# Altium schematic sheet MainBoard.SchDoc
size A4; SheetNumber: 1; SheetTotal: 1
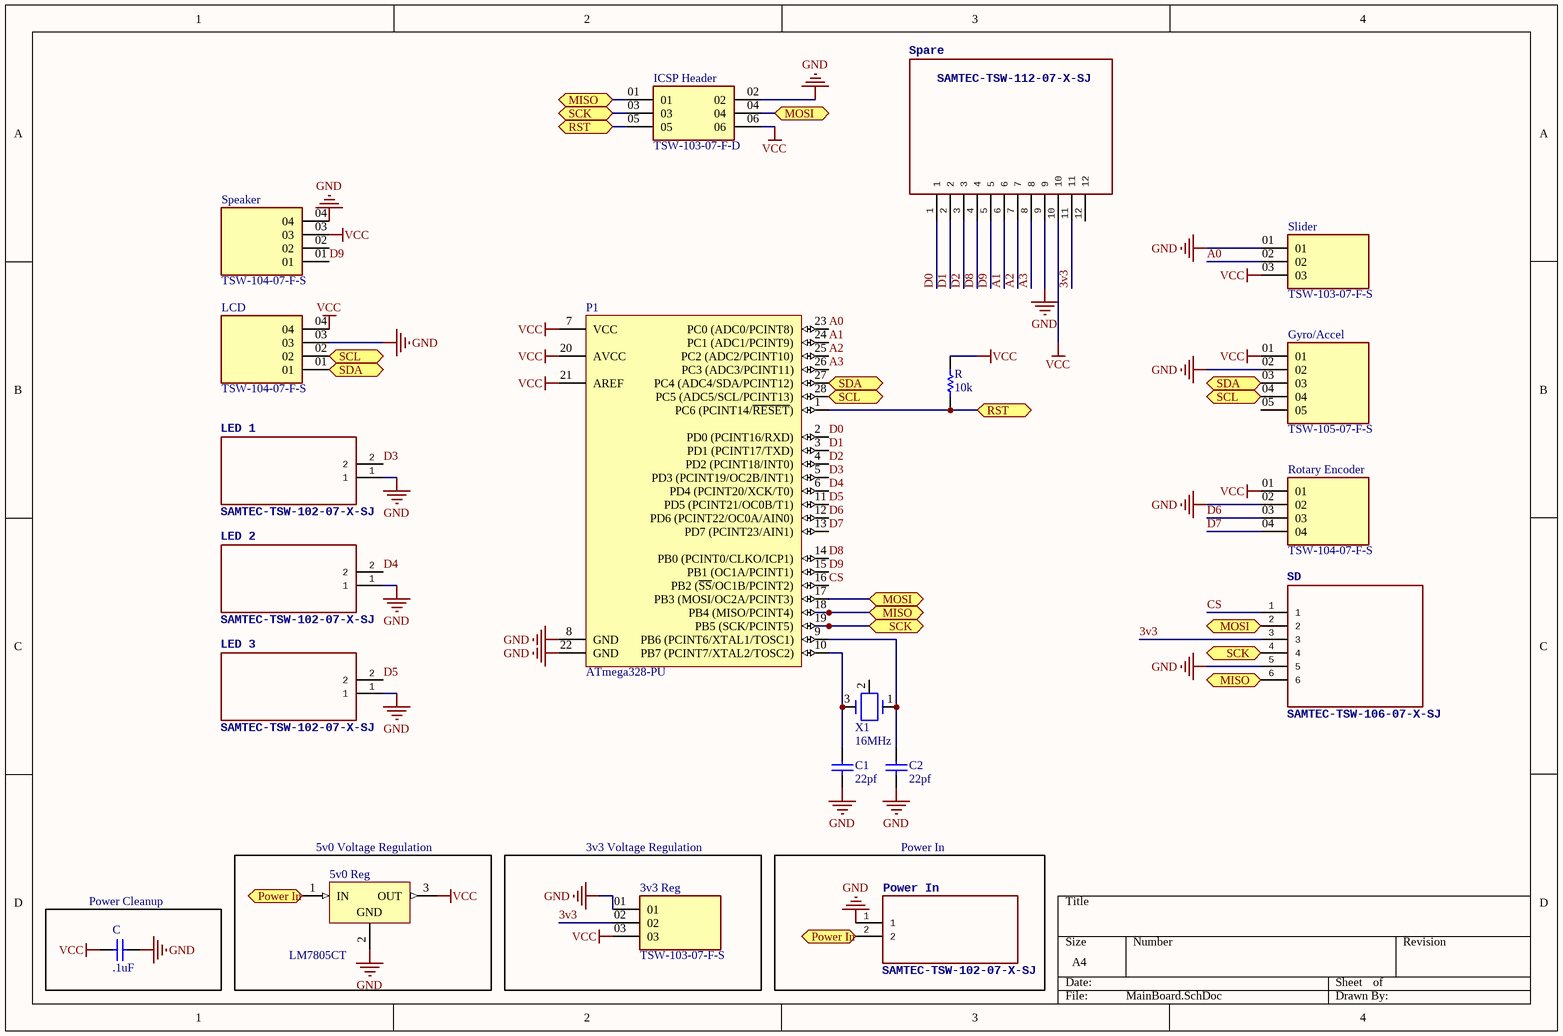
[diagram p0: MainBoard.SchDoc]

## Parts
3v3_Reg  TSW-103-07-F-S  [SAMTEC_TSW-103-07-F-S]
5v0_Reg  LM7805CT  [FAIR-TO-220-3]
C  .1uF  [KEMT-C330C105M5U5TA]
C1  22pf  [KEMT-C330C105M5U5TA]
C2  22pf  [KEMT-C330C105M5U5TA]
Gyro/Accel  TSW-105-07-F-S  [SAMTEC_TSW-105-07-F-S]
ICSP_Header  TSW-103-07-F-D  [SAMTEC_TSW-103-07-F-D]
LCD  TSW-104-07-F-S  [SAMTEC_TSW-104-07-F-S]
LED_1  SAMTEC-TSW-102-07-X-SJ  [SAMTEC-TSW-102-07-X-S]
LED_2  SAMTEC-TSW-102-07-X-SJ  [SAMTEC-TSW-102-07-X-S]
LED_3  SAMTEC-TSW-102-07-X-SJ  [SAMTEC-TSW-102-07-X-S]
P1  ATmega328-PU  [28P3]
Power_In  SAMTEC-TSW-102-07-X-SJ  [SAMTEC-TSW-102-07-X-S]
R  10k  [VISH-A1-2_V2]
Rotary_Encoder  TSW-104-07-F-S  [SAMTEC_TSW-104-07-F-S]
SD  SAMTEC-TSW-106-07-X-SJ  [SAMTEC-TSW-106-07-X-S]
Slider  TSW-103-07-F-S  [SAMTEC_TSW-103-07-F-S]
Spare  SAMTEC-TSW-112-07-X-SJ  [SAMTEC-TSW-112-07-X-S]
Speaker  TSW-104-07-F-S  [SAMTEC_TSW-104-07-F-S]
X1  16MHz  [ECS-4X-3IL]

## Blocks framed on the sheet
5v0 Voltage Regulation: 5v0_Reg
3v3 Voltage Regulation: 3v3_Reg
Power In: Power_In
Power Cleanup: C

## Ports
MISO (bidir, see MainBoard[2A], MainBoard[3C]), MISO (bidir, see MainBoard[2A], MainBoard[4C]), MISO (bidir, see MainBoard[3C], MainBoard[4C]), MOSI (bidir, see MainBoard[2A], MainBoard[3C]), MOSI (bidir, see MainBoard[2A], MainBoard[4C]), MOSI (bidir, see MainBoard[3C], MainBoard[4C]), Power In (bidir, see MainBoard[1D]), Power In (bidir, see MainBoard[3D]), RST (bidir, see MainBoard[2A]), RST (bidir, see MainBoard[3B]), SCK (bidir, see MainBoard[2A], MainBoard[3C]), SCK (bidir, see MainBoard[2A], MainBoard[4C]), SCK (bidir, see MainBoard[3C], MainBoard[4C]), SCL (bidir, see MainBoard[1B], MainBoard[3B]), SCL (bidir, see MainBoard[1B], MainBoard[4B]), SCL (bidir, see MainBoard[3B], MainBoard[4B]), SDA (bidir, see MainBoard[1B], MainBoard[3B]), SDA (bidir, see MainBoard[1B], MainBoard[4B]), SDA (bidir, see MainBoard[3B], MainBoard[4B])

## Nets
GND: 3v3_Reg.01 5v0_Reg.2(GND) C.2 C1.1 C2.1 Gyro/Accel.02 ICSP_Header.02 LCD.03 LED_1.1 LED_2.1 LED_3.1 P1.8(GND) P1.22(GND) Power_In.1 Rotary_Encoder.02 SD.5 Slider.01 Spare.9 Speaker.04
VCC: 3v3_Reg.03 5v0_Reg.3(OUT) C.1 Gyro/Accel.01 ICSP_Header.06 LCD.04 P1.7(VCC) P1.20(AVCC) P1.21(AREF) R.2 Rotary_Encoder.01 Slider.03 Spare.10 Speaker.03
3v3: 3v3_Reg.02 SD.3 Spare.11
A0: P1.23(PC0_(ADC0/PCINT8)) Slider.02
A1: P1.24(PC1_(ADC1/PCINT9)) Spare.6
A2: P1.25(PC2_(ADC2/PCINT10)) Spare.7
A3: P1.26(PC3_(ADC3/PCINT11)) Spare.8
CS: P1.16(PB2_(~{SS}/OC1B/PCINT2)) SD.1
D0: P1.2(PD0_(PCINT16/RXD)) Spare.1
D1: P1.3(PD1_(PCINT17/TXD)) Spare.2
D2: P1.4(PD2_(PCINT18/INT0)) Spare.3
D3: LED_1.2 P1.5(PD3_(PCINT19/OC2B/INT1))
D4: LED_2.2 P1.6(PD4_(PCINT20/XCK/T0))
D5: LED_3.2 P1.11(PD5_(PCINT21/OC0B/T1))
D6: P1.12(PD6_(PCINT22/OC0A/AIN0)) Rotary_Encoder.03
D7: P1.13(PD7_(PCINT23/AIN1)) Rotary_Encoder.04
D8: P1.14(PB0_(PCINT0/CLKO/ICP1)) Spare.4
D9: P1.15(PB1_(OC1A/PCINT1)) Spare.5 Speaker.01
MISO: ICSP_Header.01 P1.18(PB4_(MISO/PCINT4)) SD.6 ; port MISO
MOSI: ICSP_Header.04 P1.17(PB3_(MOSI/OC2A/PCINT3)) SD.2 ; port MOSI
Power In: 5v0_Reg.1(IN) Power_In.2 ; port Power In
RST: ICSP_Header.05 P1.1(PC6_(PCINT14/~{RESET})) R.1 ; port RST
SCK: ICSP_Header.03 P1.19(PB5_(SCK/PCINT5)) SD.4 ; port SCK
SCL: Gyro/Accel.04 LCD.02 P1.28(PC5_(ADC5/SCL/PCINT13)) ; port SCL
SDA: Gyro/Accel.03 LCD.01 P1.27(PC4_(ADC4/SDA/PCINT12)) ; port SDA
NetC1_2: C1.2 P1.10(PB7_(PCINT7/XTAL2/TOSC2)) X1.3
NetC2_2: C2.2 P1.9(PB6_(PCINT6/XTAL1/TOSC1)) X1.1

Not connected (* = marked no-connect by the designer): Gyro/Accel 05; Spare 12; Speaker 02; X1 2

## Library data of the parts
3v3_Reg Slider = TSW-103-07-F-S: MF: Samtec; Package: None; Price: None; MP: TSW-103-07-F-S; Availability: Unavailable; Value: *
5v0_Reg = CMP-2000-04938-1: Positive Voltage Regulator, 5 V, 1 A, -40 to 125 degC, 3-Pin TO-220, RoHS, Tube; Manufacturer: FairchildSemiconductor; Maximum Input Voltage: 35V; Maximum Quiescent Current: 8mA; Load Regulation: 100mV; Maximum Output Current: 2.2(Typ)A; Output Type: Fixed; Typical Dropout Voltage @ Current: 2@1AV; Rad Hard: No; Output Voltage: 5V; Accuracy: ±4%; Number of Outputs: 1; Category: LinearRegulator; Package Description: 3-Pin Through Hole Device, Body 10 x 4.5 mm, Pitch 2.54 mm; Packaging: Rail/Tube; Mounting: ThroughHole; Polarity: Positive; Manufacturer URL: https://www.fairchildsemi.com/; Line Regulation: 100mV; Datasheet Version: Aug-12; Datasheet URL: https://datasheet.ciiva.com/26904/lm7805ct-26904988.pdf; Package Reference: TO-220; Package URL: https://www.fairchildsemi.com/package-drawings/TO/TO220B03.pdf; Package: 3TO-220AB; Operating Temperature: -40to125degC; Type: Linear
C C1 C2 = CMP-2000-06056-1: Ceramic Capacitor, 1 uF, +/- 20%, 50 V, -10 to 85 degC, 2-Pin THD, RoHS, Bulk; Manufacturer: Kemet; Voltage - Rated: 50V; Temperature Coefficient: Z5U; Catalog Drawings: C330(std); Product Training Modules: CapacitorBasics-TypicalUsesforCapacitors; Capacitance: 1µF; Online Catalog: GoldenMax™Series; Other Names: 399-4390; PCN Design/Specification: C3yySeriesGoldenMaxLeadConfiguration02/Feb/2015; Thickness (Max): -; Size / Dimension: 0.300"Lx0.150"W(7.62mmx3.81mm); Mounting Technology: ThroughHole; Tolerance: ±20%; Mounting Type: ThroughHole; Datasheet URL: http://www.kemet.com/Lists/ProductCatalog/Attachments/599/KEM_C1051_GOLDMAX_Z5U.pdf; Series: GoldenMax™; Standard Package: 250; Ratings: -; Applications: GeneralPurpose; Package Reference: C330C105M5U5TA; Packaging: Bulk; Category: Capacitors; Package Description: 2-Pin Through Hole Device, Body 7.11 x 4.07 mm; Operating Temperature: 10°C~85°C; Height - Seated (Max): 0.360"(9.14mm); Manufacturer URL: http://www.kemet.com/; Lead Spacing: 0.200"(5.08mm); Features: -; Lead Style: Straight; Package / Case: Radial; Family: CeramicCapacitors; Datasheet Version: 12/2015
Gyro/Accel = TSW-105-07-F-S: MF: Samtec; Value: *; MP: TSW-105-07-F-S; Price: None; Availability: Unavailable; Package: None
ICSP_Header = TSW-103-07-F-D: MF: Samtec; Package: None; Availability: Unavailable; Value: *; MP: TSW-103-07-F-D; Price: None
LCD Rotary_Encoder Speaker = TSW-104-07-F-S: MF: Samtec; MP: TSW-104-07-F-S; Price: None; Package: None; Availability: Unavailable; Value: *
P1 = CMP-0095-00015-2: 8-bit AVR Microcontroller, 32KB Flash, 1KB EEPROM, 2KB SRAM, 28-pin PDIP, Industrial Grade (-40°C to 85°C); ComponentLink3Description: ATmega48A/48PA/88A/88PA/168A/168PA/328/328P Summary; RevisionNote: DatasheetVersion updated. URLs added.; DatasheetVersion: revD, May-2011; ComponentLink1URL: http://www.atmel.com/; PackageVersion: revB, Sep-2001; PackageDescription: 28-lead (0.300"/7.62mm Wide) Plastic Dual Inline Package (PDIP); PackageReference: 28P3; ComponentLink1Description: Manufacturer URL; ComponentLink2Description: ATmega48A/48PA/88A/88PA/168A/168PA/328/328P Datasheet; ComponentLink3URL: http://www.atmel.com/dyn/resources/prod_documents/8271S.pdf; ComponentLink2URL: http://www.atmel.com/dyn/resources/prod_documents/8271.pdf
R = CMP-1240-00001-1: Power Metal Film Leaded Resistor, 62 KOhm +/-5%, 2 W, 2-Pin THD, RoHS, Ammo Pack; PartNumber: PR02000206202JA100; Manufacturer: Vishay Semiconductor; Resistance: 62 KOhm; Temperature Coefficient: +/-250 ppm/degC; Power: 2 W; ComponentLink2URL: http://www.vishay.com/docs/28729/28729.pdf; Mounting Technology: Through Hole; Tolerance: +/-5%; ComponentLink3Description: Package Specification; ComponentLink3URL: http://www.vishay.com/docs/28729/28729.pdf; ComponentLink1Description: Manufacturer URL; ComponentLink2Description: Datasheet; DatasheetVersion: Jun-13; PackageDescription: 2-Pin Axial Lead, Body 10 x 3.9 mm; ComponentLink1URL: http://www.vishay.com/; Packing: Ammo Pack; RoHS: TRUE
X1 = CMP-1669-00002-2: CRYSTAL 8.00 MHZ 20PF 49US; PartNumber: ECS-80-20-4X; Manufacturer: ECS; ComponentLink1URL: http://www.ecsxtal.com/store/pdf/hc-49usx.pdf; ComponentLink1Description: Datasheet; PackageReference: 4X-3IL